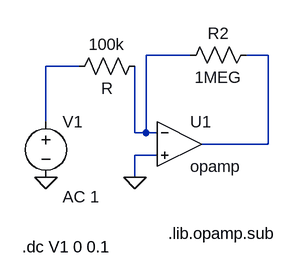
[diagram p0: schematic Scematic01.asc]
Scematic01.asc, the LTspice schematic file:
Version 4
SHEET 1 880 680
WIRE 208 32 144 32
WIRE 320 32 288 32
WIRE 48 48 0 48
WIRE 0 128 0 48
WIRE 128 144 128 48
WIRE 144 144 144 32
WIRE 144 144 128 144
WIRE 160 144 144 144
WIRE 320 160 320 32
WIRE 320 160 224 160
WIRE 160 176 128 176
WIRE 128 208 128 176
FLAG 0 208 0
FLAG 128 208 0
SYMBOL voltage 0 112 R0
WINDOW 123 24 124 Left 2
WINDOW 39 0 0 Left 2
SYMATTR InstName V1
SYMATTR Value ""
SYMATTR Value2 AC 1
SYMBOL Opamps\\opamp 192 96 R0
SYMATTR InstName U1
SYMBOL res 144 32 R90
WINDOW 0 0 56 VBottom 2
WINDOW 3 32 56 VTop 2
SYMATTR InstName 100k
SYMBOL res 304 16 R90
WINDOW 0 0 56 VBottom 2
WINDOW 3 32 56 VTop 2
SYMATTR InstName R2
SYMATTR Value 1MEG
TEXT 176 288 Left 2 !.lib.opamp.sub
TEXT -34 308 Left 2 !.dc V1 0 0.1

The netlist it stands for:
* Scematic01.asc
V1 N003 0 AC 1
XU1 N001 0 N002 opamp Aol=100K GBW=10Meg  ; pins invin noninvin out
R§100k N001 N003 R
R2 N002 N001 1MEG
.lib.opamp.sub
.dc V1 0 0.1
.backanno
.end